# EAGLE design board (EAGLE 9.2.2)
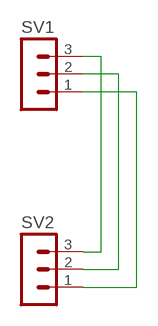
[diagram p0: schematic, sheet 1]

## Parts
SV1  MA03-1  [MA03-1]
SV2  MA03-1  [MA03-1]

## Nets
N$1: SV1.1 SV2.1
N$2: SV1.2 SV2.2
N$3: SV1.3 SV2.3

## Library data of the parts
SV1 SV2 = con-lstb:MA03-1: PIN HEADER; OC_FARNELL: unknown; OC_NEWARK: unknown

## Board
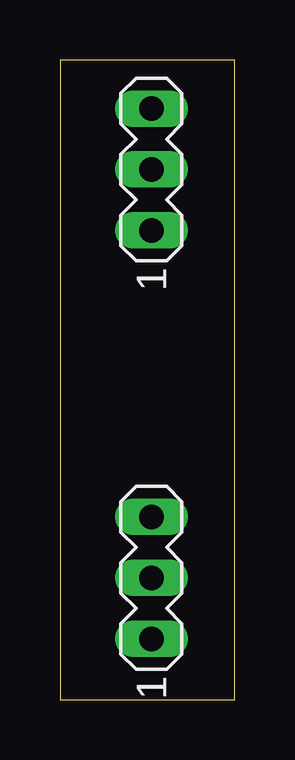
[diagram p1: board, top side]
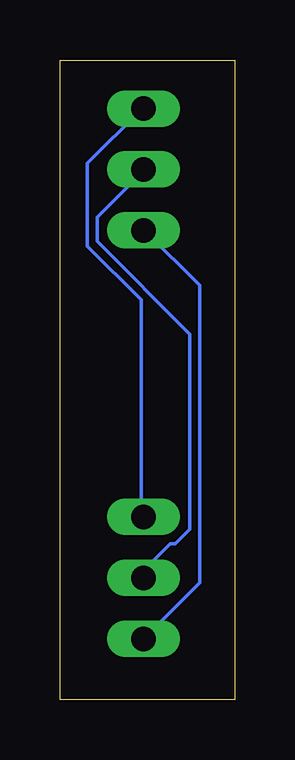
[diagram p2: board, bottom side, seen from below]

Size 7.29 x 26.66 mm. Coordinates in mm from the lower left corner, seen from the top.
Outline: 0,0 7.29,0 7.29,26.66 0,26.66 0,0
Copper layers (1*16): Top 0.035mm / dielectric 1.5mm / Bottom 0.035mm
Design rules "default *": minimum track width 6mil, minimum drill 0.35mm, track to track 10mil, track to pad 10mil, pad to pad 10mil, via to via 10mil, smd to smd 10mil, copper to edge 40mil, drill to drill 6mil, minimum pad ring 10mil, minimum via ring 8mil, stop-mask expansion 4mil, vias tented up to drill 0mil, thermal gap 10mil

### Footprints (pad centres in the part's own frame; a part is rotated, then mirrored left to right if it is on the bottom)
MA03-1 = drill 1.016 long: 1 -2.54,0; 2 0,0; 3 2.54,0

### Placement (x,y rotation side)
SV1  3.81,5.08 90 top
SV2  3.81,22.1 90 top

### Tracks (layer width: path | path; a pad name or v marks a point on that pad's centre or on a via)
N$1
  Top 0.152: 3.71,2.9 3.71,2.85 | 3.71,2.85 3.71,2.64 | 3.71,2.64 3.71,2.59 | 3.81,19.15 SV2.1 3.71,19.51 | 3.71,2.64 SV1.1 3.71,2.85
  Bottom 0.152: 3.86,2.9 3.86,2.59 SV1.1 1.47,4.88 1.47,17.27 3.71,19.51 SV2.1 3.86,19.56
N$2
  Top 0.152: 3.71,5.18 SV1.2 3.71,5.08 | 3.91,21.95 SV2.2
  Bottom 0.152: 3.71,5.49 3.71,5.18 SV1.2 3.71,5.49 | 3.71,5.49 2.69,6.5 2.49,6.5 1.88,7.11 1.88,15.24 5.74,19.1 5.74,20.12 3.91,21.95 SV2.2
N$3
  Top 0.152: 3.71,7.62 SV1.3 | 3.71,24.59 SV2.3 3.91,24.59 | 3.86,7.62 SV1.3 | 3.91,7.72 SV1.3
  Bottom 0.152: SV1.3 3.91,7.72 3.91,16.66 6.15,18.9 6.15,22.35 3.91,24.59 SV2.3